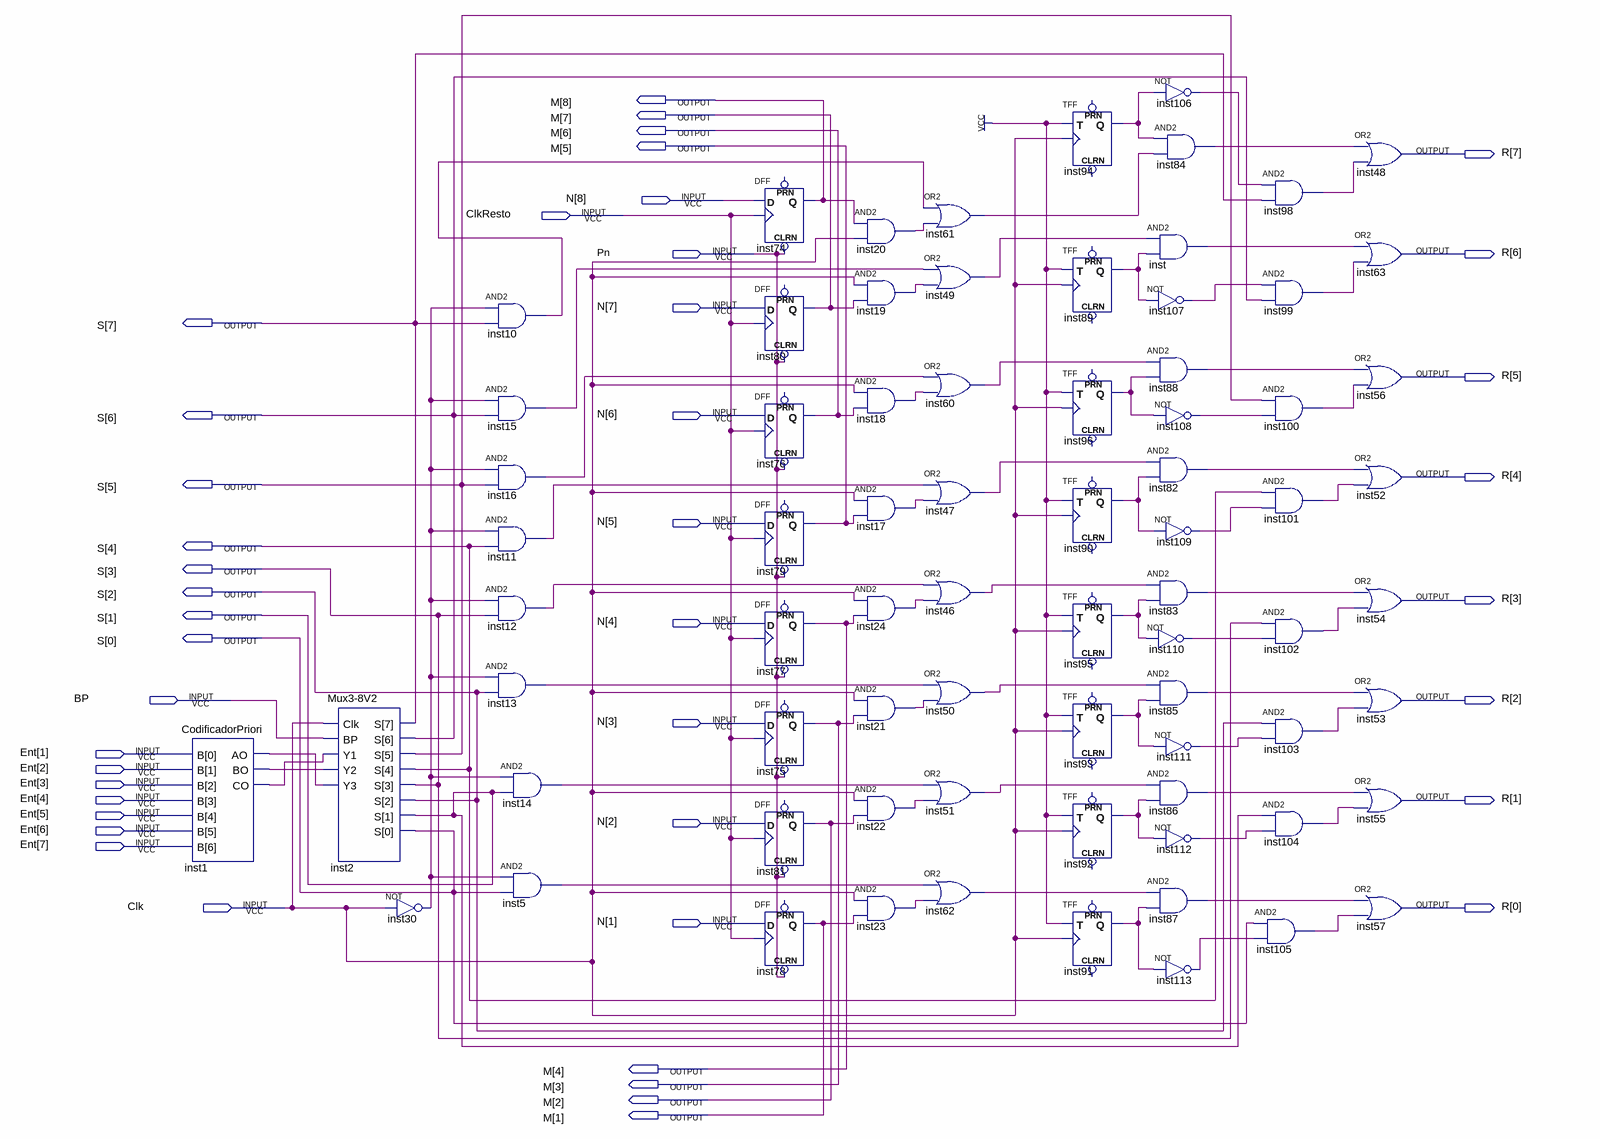
[diagram p0: schematic sheet]
// Quartus schematic ControleCol.bdf as structural Verilog: 75 symbols, 43 pins
module ControleCol (
  input  [8:1] N,
  input  ClkResto,
  input  Pn,
  input  BP,
  input  [7:1] Ent,
  input  Clk,
  output [8:1] M,
  output [7:0] R,
  output [7:0] S
);

  wire inst1_ao, inst1_bo, inst1_co, inst5_out, inst10_out, inst11_out, inst12_out, inst13_out, inst14_out,
       inst15_out, inst16_out, inst17_out, inst18_out, inst19_out, inst20_out, inst21_out, inst22_out,
       inst23_out, inst24_out, inst30_out, inst46_out, inst47_out, inst49_out, inst50_out, inst51_out,
       inst60_out, inst61_out, inst62_out, inst82_out, inst83_out, inst84_out, inst85_out, inst86_out,
       inst87_out, inst88_out, inst89_q, inst90_q, inst91_q, inst92_q, inst93_q, inst94_q, inst95_q,
       inst96_q, inst98_out, inst99_out, inst100_out, inst101_out, inst102_out, inst103_out, inst104_out,
       inst105_out, inst106_out, inst107_out, inst108_out, inst109_out, inst110_out, inst111_out,
       inst112_out, inst113_out, inst_out;

  CodificadorPriori inst1 (.B(Ent), .AO(inst1_ao), .BO(inst1_bo), .CO(inst1_co));
  \Mux3-8V2  inst2 (.Clk(Clk), .BP(BP), .Y1(inst1_co), .Y2(inst1_bo), .Y3(inst1_ao), .S(S));
  not inst30 (inst30_out, Clk);
  and inst10 (inst10_out, inst30_out, S[7]);
  and inst15 (inst15_out, inst30_out, S[6]);
  and inst16 (inst16_out, inst30_out, S[5]);
  and inst11 (inst11_out, inst30_out, S[4]);
  and inst12 (inst12_out, inst30_out, S[3]);
  and inst13 (inst13_out, inst30_out, S[2]);
  and inst14 (inst14_out, inst30_out, S[1]);
  and inst5 (inst5_out, inst30_out, S[0]);
  DFF inst74 (.CLRN(Pn), .CLK(ClkResto), .D(N[8]), .Q(M[8]));  // open: PRN
  DFF inst80 (.CLRN(Pn), .CLK(ClkResto), .D(N[7]), .Q(M[7]));  // open: PRN
  DFF inst76 (.CLRN(Pn), .CLK(ClkResto), .D(N[6]), .Q(M[6]));  // open: PRN
  DFF inst79 (.CLRN(Pn), .CLK(ClkResto), .D(N[5]), .Q(M[5]));  // open: PRN
  DFF inst77 (.CLRN(Pn), .CLK(ClkResto), .D(N[4]), .Q(M[4]));  // open: PRN
  DFF inst75 (.CLRN(Pn), .CLK(ClkResto), .D(N[3]), .Q(M[3]));  // open: PRN
  DFF inst81 (.CLRN(Pn), .CLK(ClkResto), .D(N[2]), .Q(M[2]));  // open: PRN
  DFF inst78 (.CLRN(Pn), .CLK(ClkResto), .D(N[1]), .Q(M[1]));  // open: PRN
  and inst20 (inst20_out, M[8], Clk);
  and inst19 (inst19_out, Clk, M[7]);
  and inst18 (inst18_out, Clk, M[6]);
  and inst17 (inst17_out, Clk, M[5]);
  and inst24 (inst24_out, Clk, M[4]);
  and inst21 (inst21_out, Clk, M[3]);
  and inst22 (inst22_out, Clk, M[2]);
  and inst23 (inst23_out, Clk, M[1]);
  or inst61 (inst61_out, inst10_out, inst20_out);
  or inst49 (inst49_out, inst15_out, inst19_out);
  or inst60 (inst60_out, inst16_out, inst18_out);
  or inst47 (inst47_out, inst11_out, inst17_out);
  or inst46 (inst46_out, inst12_out, inst24_out);
  or inst50 (inst50_out, inst13_out, inst21_out);
  or inst51 (inst51_out, inst14_out, inst22_out);
  or inst62 (inst62_out, inst5_out, inst23_out);
  TFF inst94 (.T(1'b1), .CLK(Clk), .Q(inst94_q));  // open: PRN, CLRN
  TFF inst89 (.T(1'b1), .CLK(Clk), .Q(inst89_q));  // open: PRN, CLRN
  TFF inst96 (.T(1'b1), .CLK(Clk), .Q(inst96_q));  // open: PRN, CLRN
  TFF inst90 (.T(1'b1), .CLK(Clk), .Q(inst90_q));  // open: PRN, CLRN
  TFF inst95 (.T(1'b1), .CLK(Clk), .Q(inst95_q));  // open: PRN, CLRN
  TFF inst93 (.T(1'b1), .CLK(Clk), .Q(inst93_q));  // open: PRN, CLRN
  TFF inst92 (.T(1'b1), .CLK(Clk), .Q(inst92_q));  // open: PRN, CLRN
  TFF inst91 (.T(1'b1), .CLK(Clk), .Q(inst91_q));  // open: PRN, CLRN
  not inst106 (inst106_out, inst94_q);
  and inst84 (inst84_out, inst94_q, inst61_out);
  and inst (inst_out, inst49_out, inst89_q);
  not inst107 (inst107_out, inst89_q);
  and inst88 (inst88_out, inst60_out, inst96_q);
  not inst108 (inst108_out, inst96_q);
  and inst82 (inst82_out, inst47_out, inst90_q);
  not inst109 (inst109_out, inst90_q);
  and inst83 (inst83_out, inst46_out, inst95_q);
  not inst110 (inst110_out, inst95_q);
  and inst85 (inst85_out, inst50_out, inst93_q);
  not inst111 (inst111_out, inst93_q);
  and inst86 (inst86_out, inst51_out, inst92_q);
  not inst112 (inst112_out, inst92_q);
  and inst87 (inst87_out, inst62_out, inst91_q);
  not inst113 (inst113_out, inst91_q);
  and inst105 (inst105_out, S[0], inst113_out);
  and inst98 (inst98_out, inst106_out, S[7]);
  and inst99 (inst99_out, inst107_out, S[6]);
  and inst100 (inst100_out, S[5], inst108_out);
  and inst101 (inst101_out, S[4], inst109_out);
  and inst102 (inst102_out, S[3], inst110_out);
  and inst103 (inst103_out, S[2], inst111_out);
  and inst104 (inst104_out, S[1], inst112_out);
  or inst48 (R[7], inst84_out, inst98_out);
  or inst63 (R[6], inst_out, inst99_out);
  or inst56 (R[5], inst88_out, inst100_out);
  or inst52 (R[4], inst82_out, inst101_out);
  or inst54 (R[3], inst83_out, inst102_out);
  or inst53 (R[2], inst85_out, inst103_out);
  or inst55 (R[1], inst86_out, inst104_out);
  or inst57 (R[0], inst87_out, inst105_out);
endmodule
